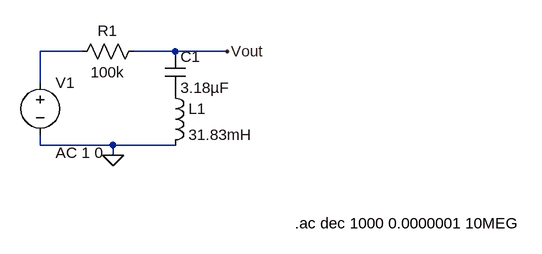
[diagram p0: schematic RLC.asc]
RLC.asc, the LTspice schematic file:
Version 4.1
SHEET 1 880 680
WIRE 96 112 32 112
WIRE 240 112 176 112
WIRE 320 112 240 112
WIRE 32 160 32 112
WIRE 32 256 32 240
WIRE 144 256 32 256
WIRE 240 256 144 256
WIRE 144 272 144 256
FLAG 320 112 Vout
FLAG 144 272 0
SYMBOL cap 224 112 R0
SYMATTR InstName C1
SYMATTR Value 3.18µF
SYMBOL ind 224 160 R0
SYMATTR InstName L1
SYMATTR Value 31.83mH
SYMATTR SpiceLine Rser=1m
SYMBOL res 192 96 R90
WINDOW 0 0 56 VBottom 2
WINDOW 3 32 56 VTop 2
SYMATTR InstName R1
SYMATTR Value 100k
SYMBOL voltage 32 144 R0
WINDOW 123 24 124 Left 2
WINDOW 39 0 0 Left 0
SYMATTR InstName V1
SYMATTR Value ""
SYMATTR Value2 AC 1 0
TEXT 424 376 Left 2 !.ac dec 1000 0.0000001 10MEG

The netlist it stands for:
* RLC.asc
C1 Vout P001 3.18µF
L1 P001 0 31.83mH Rser=1m
R1 Vout N001 100k
V1 N001 0 AC 1 0
.ac dec 1000 0.0000001 10MEG
.backanno
.end